# EAGLE design hotspot (EAGLE 6.4)
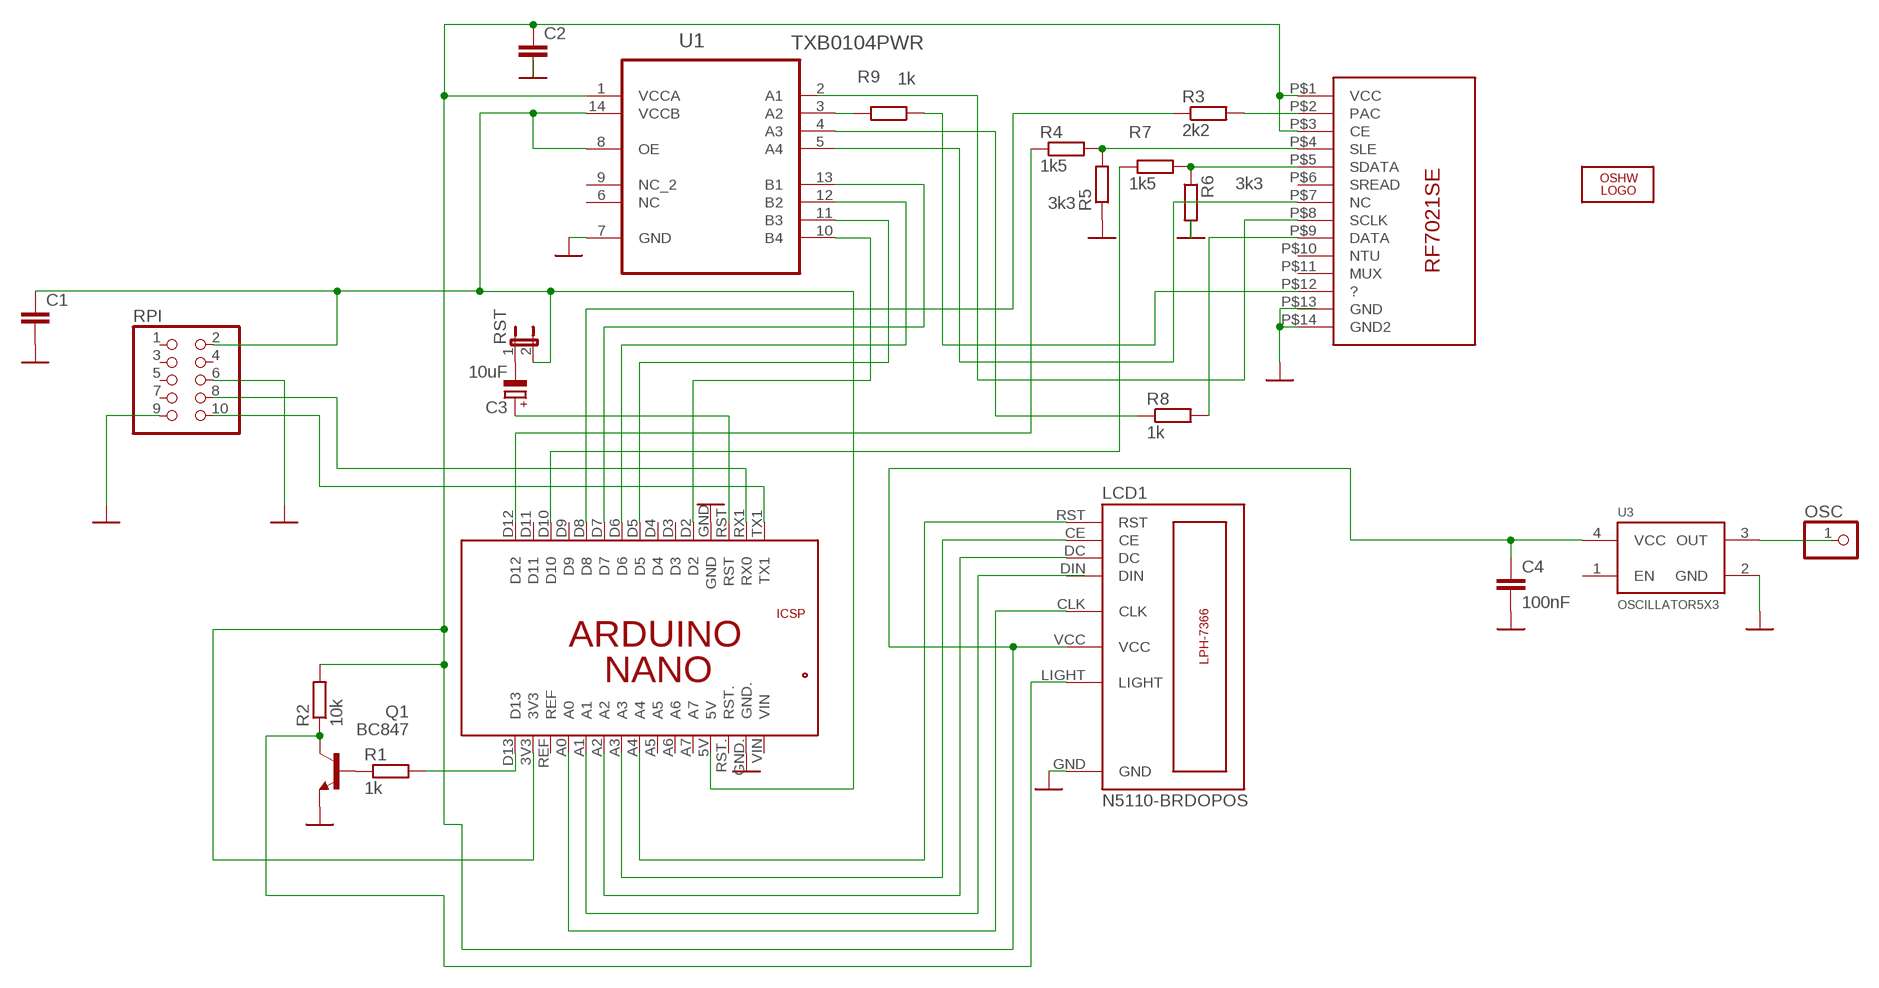
[diagram p0: schematic, sheet 1]

## Parts
C1  C-EUC0805  [C0805]
C2  C-EUC0805  [C0805]
C3  10uF  CPOL-EUSMCB  [SMC_B]
C4  100nF  C-EUC0805  [C0805]
LCD1  N5110-BRDOPOS  N5110-BRDNO-FRAME  [PH-7366-BRD-0-NOFRAME]
LOGO1  OSHW_LOGO_FILLX0150-NT  [OSHW_FILLX150_NOTEXT]
OSC  PINHD-1X1  [1X01]
PCB1  ARDUINO_NANO  [ARDUINO_NANO]
Q1  BC847  [SOT23]
R1  1k  R-EU_R0805  [R0805]
R2  10k  R-EU_R0805  [R0805]
R3  2k2  R-EU_R0805  [R0805]
R4  1k5  R-EU_R0805  [R0805]
R5  3k3  R-EU_R0805  [R0805]
R6  3k3  R-EU_R0805  [R0805]
R7  1k5  R-EU_R0805  [R0805]
R8  1k  R-EU_R0805  [R0805]
R9  1k  R-EU_R0805  [R0805]
RPI  PINHD-2X5  [2X05]
RST  JP1E  [JP1]
U1  TXB0104PWR  [SOP65P640X120-14N]
U3  OSCILLATOR5X3  [CRYSTAL-SMD-5X3]
U$1  RF7021SE  [B-RF7021SE]

## Nets
3V3: C2.1 C4.1 LCD1.VCC PCB1.3V3 R2.2 U1.1(VCCA) U3.4(VCC) U$1.P$1(VCC) U$1.P$3(CE)
5V: C1.1 PCB1.5V RPI.2 RST.2 U1.8(OE) U1.14(VCCB)
GND: C1.2 C2.2 C4.2 LCD1.GND PCB1.GND PCB1.GND. Q1.2(E) R5.1 R6.2 RPI.6 RPI.9 U1.7(GND) U3.2(GND) U$1.P$13(GND) U$1.P$14(GND2)
N$1: LCD1.RST PCB1.A4
N$2: LCD1.CE PCB1.A3
N$3: LCD1.DC PCB1.A2
N$4: LCD1.DIN PCB1.A1
N$5: LCD1.CLK PCB1.A0
N$6: R4.2 R5.2 U$1.P$4(SLE)
N$7: LCD1.LIGHT Q1.3(C) R2.1
N$8: Q1.1(B) R1.1
N$9: PCB1.D13 R1.2
N$14: R3.2 U$1.P$2(PAC)
N$15: PCB1.D8 R3.1
N$16: PCB1.D12 R4.1
N$17: PCB1.D7 U1.13(B1)
N$18: PCB1.D2 U1.10(B4)
N$19: PCB1.D5 U1.11(B3)
N$20: PCB1.D6 U1.12(B2)
N$21: R6.1 R7.2 U$1.P$5(SDATA)
N$22: PCB1.D10 R7.1
N$23: R8.2 U$1.P$9(DATA)
N$24: R8.1 U1.4(A3)
N$25: U1.2(A1) U$1.P$8(SCLK)
N$26: U1.5(A4) U$1.P$7(NC)
N$27: R9.2 U1.3(A2)
N$28: C3.- RST.1
N$29: OSC.1 U3.3(OUT)
N$32: PCB1.RX1(RX0) RPI.8
N$33: R9.1 U$1.P$12(?)
N$34: PCB1.TX1 RPI.10
N$36: C3.+ PCB1.RST
Unconnected: PCB1.5V. PCB1.A5 PCB1.A6 PCB1.A7 PCB1.D3 PCB1.D4 PCB1.D9 PCB1.D11 PCB1.GND_ PCB1.MISO PCB1.MOSI PCB1.REF PCB1.RESET.. PCB1.RST. PCB1.SCK PCB1.VIN RPI.1 RPI.3 RPI.4 RPI.5 RPI.7 U1.6(NC) U1.9(NC_2) U3.1(EN) U$1.P$6(SREAD) U$1.P$10(NTU) U$1.P$11(MUX)

## Library data of the parts
C1 C2 C4 = rcl:C-EU: CAPACITOR, European symbol
C3 = rcl:CPOL-EU: POLARIZED CAPACITOR, European symbol
LCD1 = #Nokia_LCD_5110:N5110-BRD: NOKIA 5110 LCD on BRD
LOGO1 = ohw-logo:OSHW_LOGO_FILL
OSC = pinhead:PINHD-1X1: PIN HEADER
PCB1 = E14_Arduino_published:ARDUINO_NANO: Device for representing an Arduino Nano board with a footprint in an EAGLE design. Created by Dave Young for Element14. More EAGLE documentation at: http://www.element14.com/community/community/knode/cadsoft_eagle
Q1 = transistor:BC847: NPN TRANSISTOR
R1-R9 = rcl:R-EU_: RESISTOR, European symbol
RPI = pinhead:PINHD-2X5: PIN HEADER
RST = jumper:JP1E: JUMPER
U1 = #TXB0104PWR:TXB0104PWR: 4-BIT BIDIRECTIONAL VOLTAGE-LEVEL TRANSLATOR; MPN: TXB0104PWR; OC_FARNELL: 1607891; OC_NEWARK: 99K4466; PACKAGE: TSSOP-14; SUPPLIER: Texas Instruments
U3 = #sparkfun:OSCILLATOR
U$1 = #RF7021SE:RF7021SE: RF7021SE

## Board
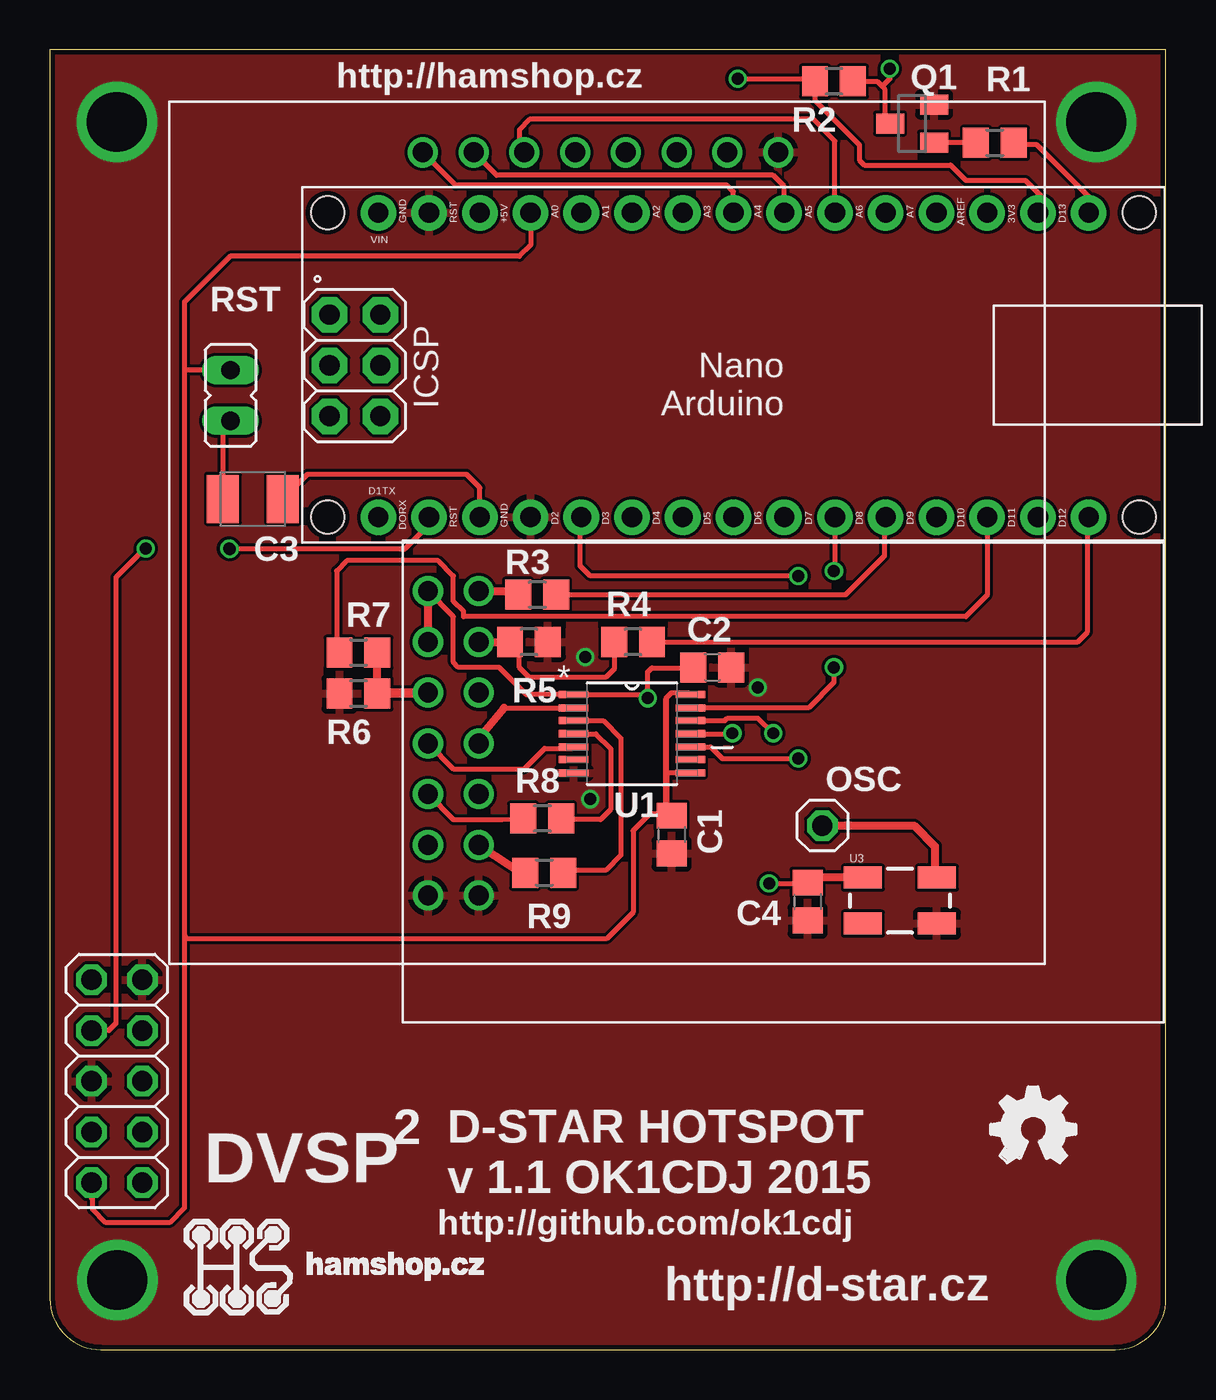
[diagram p1: board, top side]
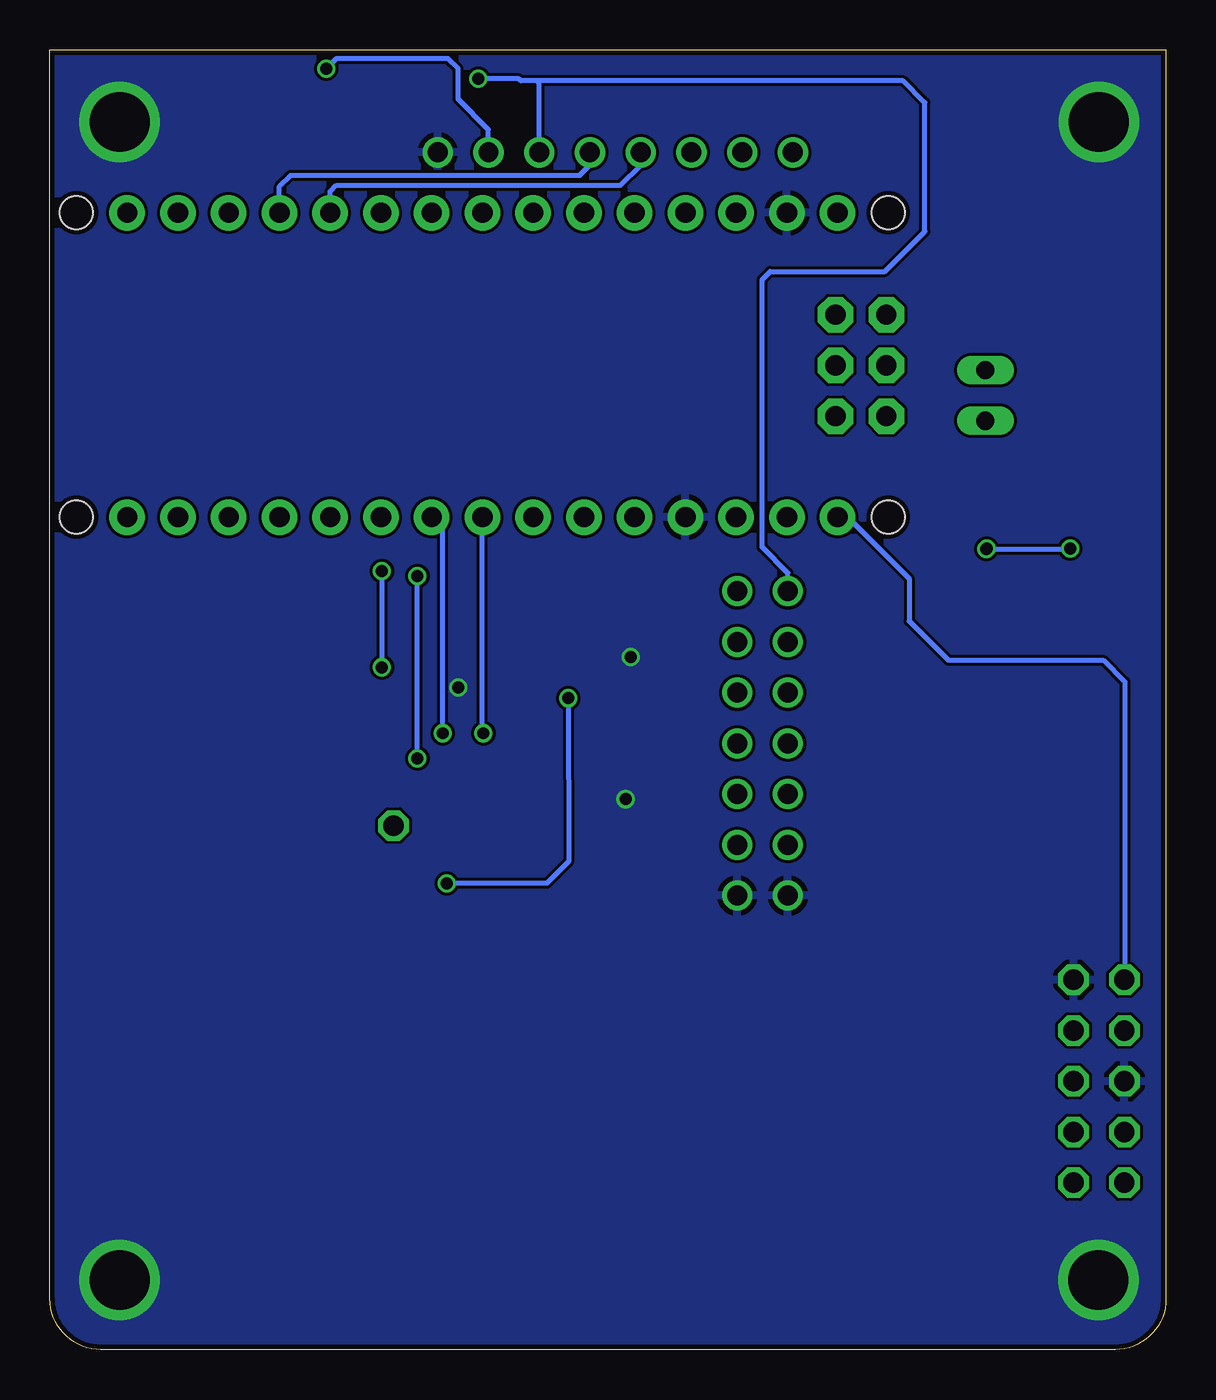
[diagram p2: board, bottom side, seen from below]

Size 55.86 x 65.08 mm. Coordinates in mm from the lower left corner, seen from the top.
Outline: 0,65.08 0,2.54 arc90 2.54,0 53.32,0 arc90 55.86,2.54 55.86,65.08 0,65.08
Copper layers (1*16): Top 0.035mm / dielectric 1.5mm / Bottom 0.035mm
Design rules "Fusion_eagle_rule_v1.1": minimum track width 6mil, minimum drill 12mil, track to track 6mil, track to pad 6mil, pad to pad 6mil, via to via 6mil, smd to smd 0mil, copper to edge 10mil, drill to drill 10mil, minimum pad ring 10mil, minimum via ring 6mil, stop-mask expansion 2mil, vias tented up to drill 100mil, thermal gap 10mil

### Footprints (pad centres in the part's own frame; a part is rotated, then mirrored left to right if it is on the bottom)
C0805 = smd 1.3 x 1.5: 1 -0.95,0; 2 0.95,0
SMC_B = smd 1.6 x 2.4: + -1.5,0; - 1.5,0
PH-7366-BRD-0-NOFRAME = drill 1: CE 15.24,40.64; CLK 22.86,40.64; DC 17.78,40.64; DIN 20.32,40.64; GND 30.48,40.64; LIGHT 27.94,40.64; RST 12.7,40.64; VCC 25.4,40.64
1X01 = drill 1.016 octagon: 1 0,0
ARDUINO_NANO = drill 1.016 pad 1.778: 3V3 6.35,1.27; 5V 31.75,1.27; A0 11.43,1.27; A1 13.97,1.27; A2 16.51,1.27; A3 19.05,1.27; A4 21.59,1.27; A5 24.13,1.27; A6 26.67,1.27; A7 29.21,1.27; D2 29.21,16.51; D3 26.67,16.51; D4 24.13,16.51; D5 21.59,16.51; D6 19.05,16.51; D7 16.51,16.51; D8 13.97,16.51; D9 11.43,16.51; D10 8.89,16.51; D11 6.35,16.51; D12 3.81,16.51; D13 3.81,1.27; GND 31.75,16.51; GND. 36.83,1.27; REF 8.89,1.27; RST 34.29,16.51; RST. 34.29,1.27; RX1 36.83,16.51; TX1 39.37,16.51; VIN 39.37,1.27 | drill 1.016 pad 1.778 octagon: 5V. 39.268,6.375; GND_ 39.268,11.455; MISO 41.808,6.375; MOSI 39.268,8.915; RESET.. 41.808,11.455; SCK 41.808,8.915 | hole 1.651: 1.27,1.27; 1.27,16.51; 41.91,16.51; 41.91,1.27
SOT23 = smd 1 x 1.4: 1 -0.95,-1.1; 2 0.95,-1.1; 3 0,1.1
R0805 = smd 1.3 x 1.5: 1 -0.95,0; 2 0.95,0
2X05 = drill 1.016 octagon: 1 -5.08,-1.27; 2 -5.08,1.27; 3 -2.54,-1.27; 4 -2.54,1.27; 5 0,-1.27; 6 0,1.27; 7 2.54,-1.27; 8 2.54,1.27; 9 5.08,-1.27; 10 5.08,1.27
JP1 = drill 0.914 long: 1 0,-1.27; 2 0,1.27
SOP65P640X120-14N = smd 1.473 x 0.356: 1 -2.921,1.956; 2 -2.921,1.295; 3 -2.921,0.66; 4 -2.921,0; 5 -2.921,-0.66; 6 -2.921,-1.295; 7 -2.921,-1.956; 8 2.921,-1.956; 9 2.921,-1.295; 10 2.921,-0.66; 11 2.921,0; 12 2.921,0.66; 13 2.921,1.295; 14 2.921,1.956
CRYSTAL-SMD-5X3 = smd 1.9 x 1.1: 1 -1.85,-1.15; 2 1.85,-1.15; 3 1.85,1.15; 4 -1.85,1.15
B-RF7021SE = drill 1: P$1 2.54,1.27; P$2 2.54,3.81; P$3 5.08,1.27; P$4 5.08,3.81; P$5 7.62,1.27; P$6 7.62,3.81; P$7 10.16,1.27; P$8 10.16,3.81; P$9 12.7,1.27; P$10 12.7,3.81; P$11 15.24,1.27; P$12 15.24,3.81; P$13 17.78,1.27; P$14 17.78,3.81

### Placement (x,y rotation side)
C1  31.12,25.78 270 top
C2  33.15,34.16 0 top
C3  10.16,42.6 180 top
C4  37.92,22.43 270 top
LCD1  5.97,19.3 0 top
LOGO1  47.09,9.35 0 top
OSC  38.66,26.24 0 top
PCB1  55.8,58.19 180 top
Q1  43.15,61.39 90 top
R1  47.29,60.43 0 top
R2  39.24,63.5 180 top
R3  24.38,37.8 180 top
R4  29.18,35.43 180 top
R5  23.98,35.43 180 top
R6  15.44,32.84 180 top
R7  15.44,34.9 0 top
R8  24.64,26.59 180 top
R9  24.74,23.88 0 top
RPI  3.35,13.44 90 top
RST  9.04,47.78 0 top
U1  29.13,30.84 0 top
U3  42.55,22.48 0 top
U$1  17.65,40.51 270 top

### Tracks (layer width: path | path; a pad name or v marks a point on that pad's centre or on a via)
3V3  (via drill 0.6)
  Top 0.254: U$1.P$1 20.19,36.7 20.19,34.42 20.45,34.16 22.48,34.16 23.85,32.79 U1.1 29.64,32.79 v29.92,32.61 29.92,33.93 30.12,34.14 32.17,34.14 C2.1 | v34.42,63.63 38.17,63.63 R2.2 38.29,62.55 40.51,60.33 40.51,59.56 40.77,59.31 45.09,59.31 45.85,58.55 48.82,58.55 49.58,57.78 49.58,57.05 PCB1.3V3 | v35.99,23.34 37.89,23.34 C4.1
  Top 0.406: U3.4 38.17,23.63 C4.1 | U$1.P$3 U$1.P$1
  Bottom 0.254: LCD1.VCC 31.37,63.4 31.5,63.53 | v34.42,63.63 32.38,63.63 32.28,63.53 31.5,63.53 | U$1.P$1 18.92,38.89 20.22,40.18 20.22,53.57 19.81,53.98 14.07,53.98 12.07,55.98 12.07,62.43 13.16,63.53 31.5,63.53 | v29.92,32.61 29.9,24.44 30.99,23.34 v35.99,23.34
5V
  Top 0.254: U1.8 30.86,28.88 | 30.86,28.88 30.86,32.64 31.12,32.89 | 31.12,32.89 31.95,32.89 U1.14 | 30.86,28.88 30.86,26.73 C1.1 31.05,26.8 30.1,26.8 | 2.08,7.57 RPI.2 2.13,8.31 2.13,7.01 2.79,6.35 5.99,6.35 6.73,7.09 6.73,20.75 | PCB1.5V 24.05,55.3 23.49,54.74 9.02,54.74 6.73,52.45 6.73,49.05 | 6.73,49.05 6.73,20.75 | RST.2 6.73,49.05 | 31.12,32.89 31.12,32.87 30.81,32.56 30.81,27 30.99,26.82 30.02,26.82 29.19,25.98 29.19,21.89 27.86,20.57 6.91,20.57 6.73,20.75
GND  (via drill 0.6, 3)
  other vias: 3.35,61.47 52.37,61.47 3.38,3.48 52.37,3.48 26.8,34.67 27.05,27.56 35.43,33.15
  pour Bottom: -1.4,-0.13 56.01,-0.13 56.01,60.07 56.01,65.15 -1.65,65.15 -1.65,-0.13
  pour Top: -0.89,-0.89 57.02,-0.89 57.02,65.41 -0.89,65.41
N$1
  Top 0.254: PCB1.A4 34.21,57.99 33.91,58.29 20.32,58.29 LCD1.RST
N$2
  Top 0.254: PCB1.A3 36.75,58.24 36.2,58.8 22.35,58.8 LCD1.CE
N$3
  Top 0.254: PCB1.A2 39.29,60.53 38.23,61.59 24,61.59 23.49,61.09 23.49,60.2 LCD1.DC
N$4
  Bottom 0.254: PCB1.A1 41.83,57.99 41.53,58.29 27.3,58.29 26.29,59.31 LCD1.DIN
N$5
  Bottom 0.254: PCB1.A0 44.37,58.24 43.81,58.8 29.34,58.8 28.83,59.31 LCD1.CLK
N$6
  Top 0.254: R4.2 28.23,34.08 27.81,33.66 24,33.66 23.49,34.16 23.49,35.39 R5.2
  Top 0.406: U$1.P$4 R5.2
N$7  (via drill 0.6)
  Top 0.254: R2.1 41.4,63.5 41.66,63.25 | 41.66,63.25 41.78,63.12 41.78,61.66 Q1.3 | v42.04,64.14 42.04,63.63 41.66,63.25
  Bottom 0.254: LCD1.LIGHT 33.91,61.09 35.43,62.61 35.43,64.14 35.94,64.64 41.53,64.64 v42.04,64.14
N$8
  Top 0.254: R1.1 44.27,60.43 Q1.1
N$9
  Top 0.254: PCB1.D13 51.99,57.73 49.4,60.33 48.35,60.33 R1.2
N$14
  Top 0.406: U$1.P$2 23.43,37.97 R3.2
N$15
  Top 0.254: R3.1 39.83,37.8 41.78,39.75 41.78,41.63 PCB1.D8
N$16
  Top 0.254: R4.1 51.43,35.43 51.94,35.94 51.94,41.63 PCB1.D12
N$17  (via drill 0.6)
  Top 0.254: PCB1.D7 39.29,39.04 v39.24,38.99 | v39.24,34.16 39.24,33.4 37.97,32.13 U1.13
  Bottom 0.254: v39.24,38.99 v39.24,34.16
N$18  (via drill 0.6)
  Top 0.254: U1.10 33.07,30.17 33.66,29.59 v37.47,29.59 | v37.47,38.73 27.05,38.73 26.54,39.24 26.54,41.63 PCB1.D2
  Bottom 0.254: v37.47,29.59 v37.47,38.73
N$19  (via drill 0.6)
  Top 0.254: U1.11 34.16,30.84 v34.16,30.86
  Bottom 0.254: v34.16,30.86 34.21,30.86 PCB1.D5
N$20  (via drill 0.6)
  Top 0.254: U1.12 33.78,31.5 33.91,31.62 35.43,31.62 v36.2,30.86
  Bottom 0.254: v36.2,30.86 36.2,41.12 PCB1.D6
N$21
  Top 0.406: R6.1 18.92,32.84 U$1.P$5 16.39,32.89 | 16.38,32.89 16.39,32.89 | 16.39,32.89 R7.2
N$22
  Top 0.254: PCB1.D10 46.91,37.77 45.85,36.7 20.7,36.7 20.7,36.96 20.19,37.47 20.19,38.73 19.43,39.5 14.86,39.5 14.35,38.99 14.35,35.04 R7.1
N$23
  Top 0.254: U$1.P$9 20.19,26.54 22.62,26.54 R8.2
N$24
  Top 0.254: U1.4 27.33,30.84 28.07,30.1 28.07,27.05 27.56,26.54 25.64,26.54 R8.1
N$25
  Top 0.254: 22.73,32.13 U1.2
  Top 0.406: U$1.P$8 21.46,30.61 22.73,32.13
N$26
  Top 0.254: U$1.P$7 20.19,29.08 23.75,29.08 24.77,30.1 26.14,30.1 U1.5
N$27
  Top 0.254: U1.3 27.69,31.5 28.58,30.61 28.58,24.77 27.81,24 25.82,24 R9.2
N$28
  Top 0.254: RST.1 8.66,46.51 C3.-
N$29
  Top 0.406: OSC.1 43.26,26.24 44.3,25.2 44.3,23.73 U3.3
N$32  (via drill 0.6)
  Top 0.254: PCB1.RX1 18.97,41.3 17.76,40.08 v8.99,40.08 v8.97,40.11 | v4.8,40.11 4.75,40.11 3.3,38.66 3.3,16.33 2.95,15.98 RPI.8
  Bottom 0.254: v8.99,40.08 4.83,40.08 v4.8,40.11
N$33
  Top 0.406: U$1.P$12 23.79,23.75 R9.1
N$34
  Bottom 0.254: PCB1.TX1 15.93,41.68 12.85,38.61 12.85,36.47 10.9,34.52 3.15,34.52 2.06,33.43 2.06,18.54 RPI.10
N$36
  Top 0.254: PCB1.RST 21.51,43.16 20.85,43.81 12.88,43.81 C3.+

### Text on the board
tNames: http://hamshop.cz | 2 | DVSP | D-STAR HOTSPOT / v 1.1 OK1CDJ 2015 | http://github.com/ok1cdj | http://d-star.cz